# Altium schematic sheet Top_Motor_Driver_Model_D203.SchDoc: TOP-Motor-Driver-Sch
size A4; DocumentNumber: 2; SheetNumber: 2; SheetTotal: 8
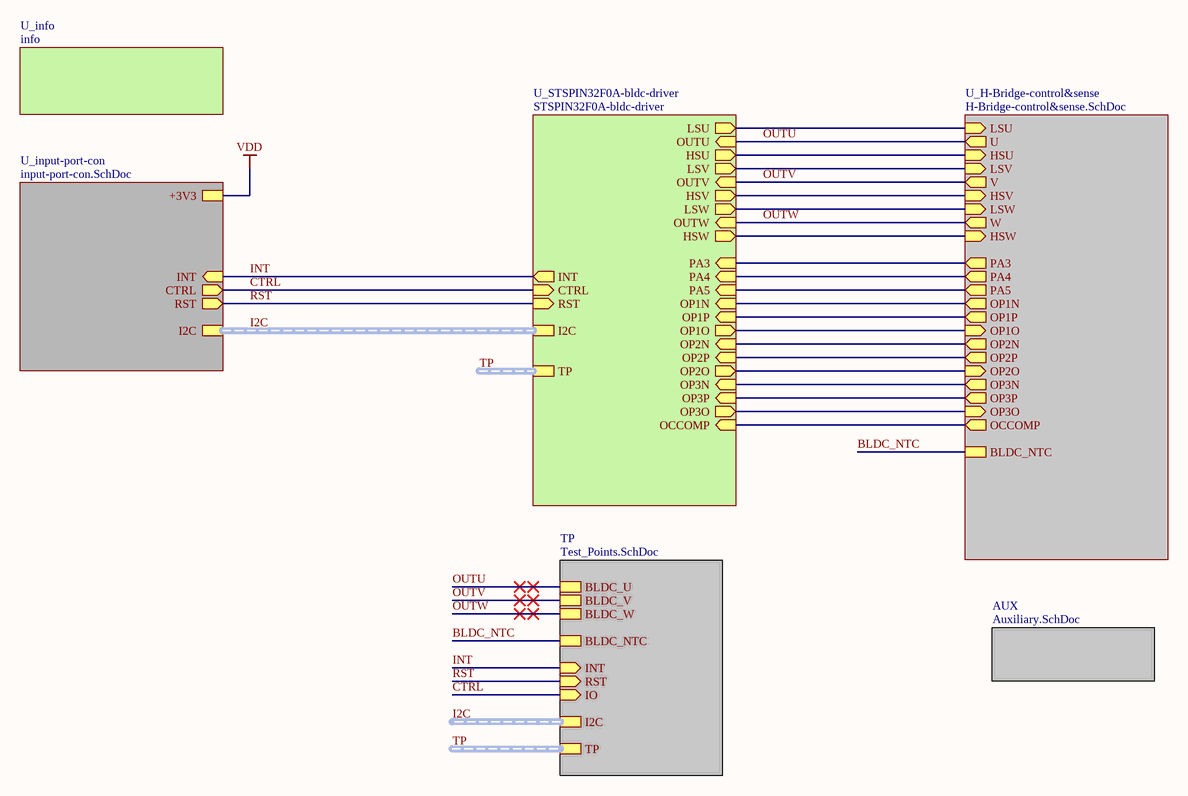
[diagram p0: Top_Motor_Driver_Model_D203.SchDoc]

## Sub-sheets
AUX = Auxiliary.SchDoc: no entries
TP = Test_Points.SchDoc: BLDC_U, BLDC_W, BLDC_V, I2C (harness I2C), BLDC_NTC, TP (harness TP), INT (in), RST (in), IO (in)
U_H-Bridge-control&sense = H-Bridge-control&sense.SchDoc: U (out), V (out), W (out), PA3 (out), PA4 (out), PA5 (out), OP1N (out), OP1P (out), OP1O (in), OP2N (out), OP2P (out), OP2O (in), OP3N (out), OP3P (out), OP3O (in), OCCOMP (out), HSU (in), LSU (in), HSV (in), LSV (in), HSW (in), LSW (in), BLDC_NTC
U_info = info: no entries
U_input-port-con = input-port-con.SchDoc: I2C (harness I2C), INT (in), RST (out), CTRL (out), +3V3
U_STSPIN32F0A-bldc-driver = STSPIN32F0A-bldc-driver: TP (harness TP), LSU (out), OUTU (in), HSU (out), LSV (out), OUTV (in), HSV (out), LSW (out), OUTW (in), HSW (out), RST (in), INT (out), CTRL (in), I2C (harness I2C), PA3 (in), PA4 (in), PA5 (in), OP1N (in), OP1P (in), OP1O (out), OP2N (in), OP2P (in), OP2O (out), OP3N (in), OP3P (in), OP3O (out), OCCOMP (in)

## Nets
VDD: sheet U_input-port-con/+3V3
BLDC_NTC: sheet TP/BLDC_NTC, sheet U_H-Bridge-control&sense/BLDC_NTC
CTRL: sheet TP/IO, sheet U_input-port-con/CTRL, sheet U_STSPIN32F0A-bldc-driver/CTRL
INT: sheet TP/INT, sheet U_input-port-con/INT, sheet U_STSPIN32F0A-bldc-driver/INT
OUTU: sheet TP/BLDC_U, sheet U_H-Bridge-control&sense/U, sheet U_STSPIN32F0A-bldc-driver/OUTU
OUTV: sheet TP/BLDC_V, sheet U_H-Bridge-control&sense/V, sheet U_STSPIN32F0A-bldc-driver/OUTV
OUTW: sheet TP/BLDC_W, sheet U_H-Bridge-control&sense/W, sheet U_STSPIN32F0A-bldc-driver/OUTW
RST: sheet TP/RST, sheet U_input-port-con/RST, sheet U_STSPIN32F0A-bldc-driver/RST
(unnamed): sheet U_H-Bridge-control&sense/PA3, sheet U_STSPIN32F0A-bldc-driver/PA3
(unnamed): sheet U_H-Bridge-control&sense/PA4, sheet U_STSPIN32F0A-bldc-driver/PA4
(unnamed): sheet U_H-Bridge-control&sense/PA5, sheet U_STSPIN32F0A-bldc-driver/PA5
(unnamed): sheet U_H-Bridge-control&sense/OP1N, sheet U_STSPIN32F0A-bldc-driver/OP1N
(unnamed): sheet U_H-Bridge-control&sense/OP1P, sheet U_STSPIN32F0A-bldc-driver/OP1P
(unnamed): sheet U_H-Bridge-control&sense/OP1O, sheet U_STSPIN32F0A-bldc-driver/OP1O
(unnamed): sheet U_H-Bridge-control&sense/OP2N, sheet U_STSPIN32F0A-bldc-driver/OP2N
(unnamed): sheet U_H-Bridge-control&sense/OP2P, sheet U_STSPIN32F0A-bldc-driver/OP2P
(unnamed): sheet U_H-Bridge-control&sense/OP2O, sheet U_STSPIN32F0A-bldc-driver/OP2O
(unnamed): sheet U_H-Bridge-control&sense/OP3N, sheet U_STSPIN32F0A-bldc-driver/OP3N
(unnamed): sheet U_H-Bridge-control&sense/OP3P, sheet U_STSPIN32F0A-bldc-driver/OP3P
(unnamed): sheet U_H-Bridge-control&sense/OP3O, sheet U_STSPIN32F0A-bldc-driver/OP3O
(unnamed): sheet U_H-Bridge-control&sense/OCCOMP, sheet U_STSPIN32F0A-bldc-driver/OCCOMP
(unnamed): sheet U_H-Bridge-control&sense/HSU, sheet U_STSPIN32F0A-bldc-driver/HSU
(unnamed): sheet U_H-Bridge-control&sense/LSU, sheet U_STSPIN32F0A-bldc-driver/LSU
(unnamed): sheet U_H-Bridge-control&sense/HSV, sheet U_STSPIN32F0A-bldc-driver/HSV
(unnamed): sheet U_H-Bridge-control&sense/LSV, sheet U_STSPIN32F0A-bldc-driver/LSV
(unnamed): sheet U_H-Bridge-control&sense/HSW, sheet U_STSPIN32F0A-bldc-driver/HSW
(unnamed): sheet U_H-Bridge-control&sense/LSW, sheet U_STSPIN32F0A-bldc-driver/LSW

## Buses and harness runs
harness I2C = sheet TP/I2C
harness I2C = sheet U_input-port-con/I2C = sheet U_STSPIN32F0A-bldc-driver/I2C
harness TP = sheet TP/TP
harness TP = sheet U_STSPIN32F0A-bldc-driver/TP

## Notes on the sheet
- Title:
- Number:
- Size:
- Date:
- A4
- Time:
- Revision:
- Sheet
- File:
- of